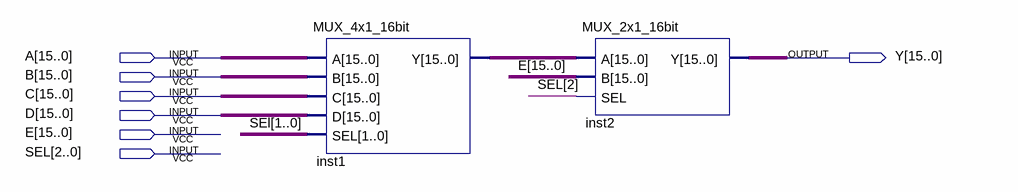
[diagram p0: schematic sheet]
// Quartus schematic MUX_5x1_16bit.bdf as structural Verilog: 2 symbols, 7 pins
module MUX_5x1_16bit (
  input  [15:0] A,
  input  [15:0] B,
  input  [15:0] C,
  input  [15:0] D,
  input  [15:0] E,
  input  [2:0] SEL,
  output [15:0] Y
);

  wire [15:0] inst1_y;

  MUX_4x1_16bit inst1 (.A(A), .B(B), .C(C), .D(D), .SEL(SEL[1:0]), .Y(inst1_y));
  MUX_2x1_16bit inst2 (.A(inst1_y), .B(E), .SEL(SEL[2]), .Y(Y));
endmodule
